# EAGLE design tiny44teardrop_v3 (EAGLE 6.5.0)
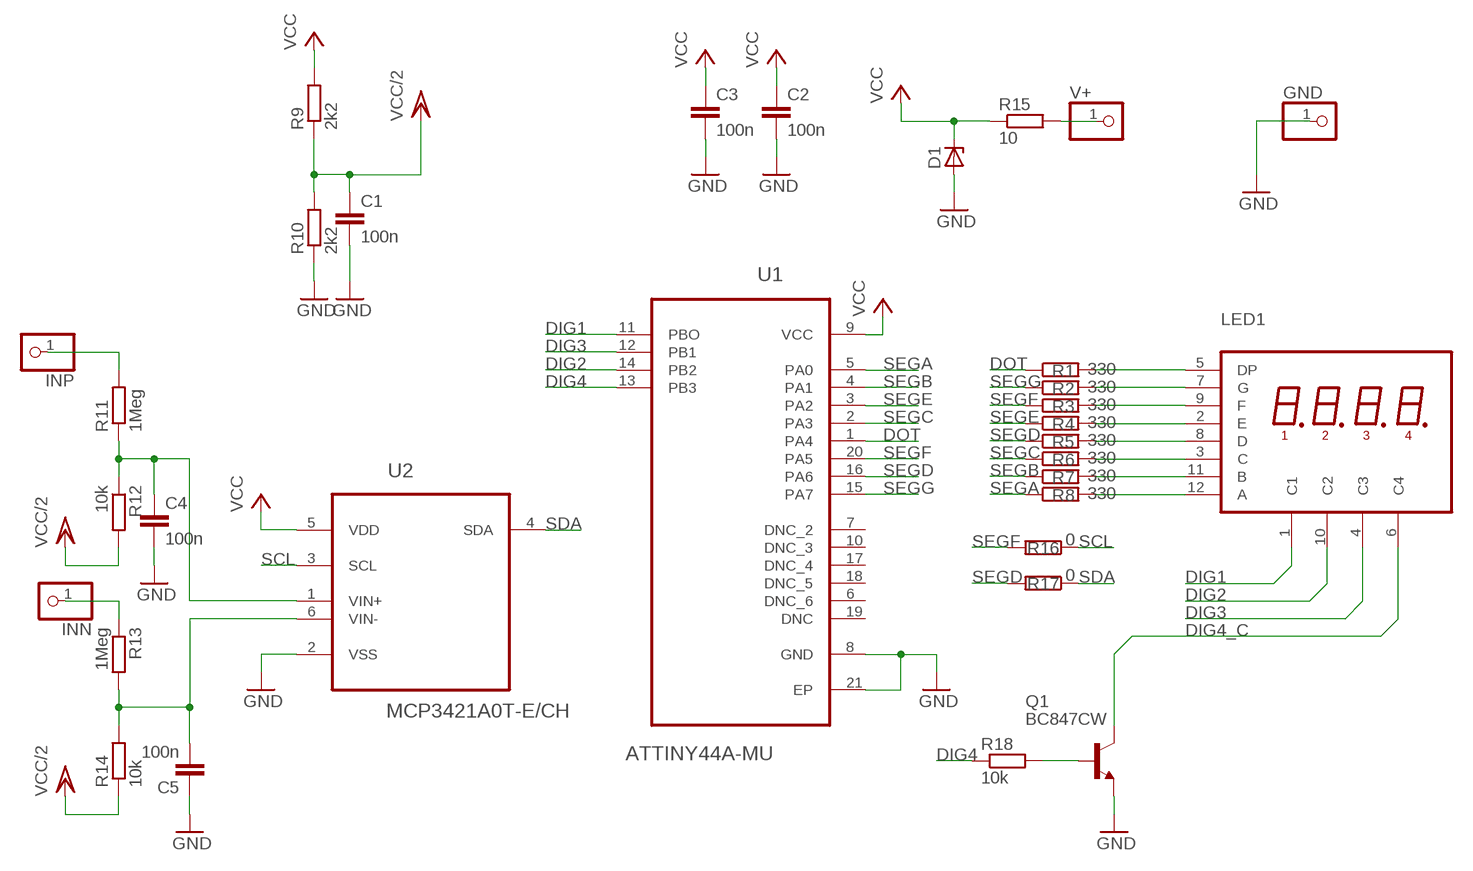
[diagram p0: schematic, sheet 1]

## Parts
C1  100n  C-EUC0603K  [C0603K]
C2  100n  C-EUC0603K  [C0603K]
C3  100n  C-EUC0603K  [C0603K]
C4  100n  C-EUC0603K  [C0603K]
C5  100n  C-EUC0603K  [C0603K]
D1  BZX84CSMDBZT52C3V3S-7-F  [SOD323-R]
GND  PINHD-1X1  [1X01]
INN  PINHD-1X1  [1X01]
INP  PINHD-1X1  [1X01]
LED1  5082-7414  [5082-7414]
Q1  BC847CW  BC847BC847CW  [SOT323-BEC]
R1  330  R-EU_R0402  [R0402]
R2  330  R-EU_R0402  [R0402]
R3  330  R-EU_R0402  [R0402]
R4  330  R-EU_R0402  [R0402]
R5  330  R-EU_R0402  [R0402]
R6  330  R-EU_R0402  [R0402]
R7  330  R-EU_R0402  [R0402]
R8  330  R-EU_R0402  [R0402]
R9  2k2  R-EU_R0402  [R0402]
R10  2k2  R-EU_R0402  [R0402]
R11  1Meg  R-EU_R0603  [R0603]
R12  10k  R-EU_R0402  [R0402]
R13  1Meg  R-EU_R0603  [R0603]
R14  10k  R-EU_R0402  [R0402]
R15  10  R-EU_R0402  [R0402]
R16  0  R-EU_R0402  [R0402]
R17  0  R-EU_R0402  [R0402]
R18  10k  R-EU_R0402  [R0402]
U1  ATTINY44A-MU  [QFN50P400X400X80-21N]
U2  MCP3421A0T-E/CH  [SOT95P270X145-6N]
V+  PINHD-1X1  [1X01]

## Nets
DIG1: LED1.1(C1) U1.11(PBO)
DIG2: LED1.10(C2) U1.14(PB2)
DIG3: LED1.4(C3) U1.12(PB1)
DIG4: R18.1 U1.13(PB3)
DIG4_C: LED1.6(C4) Q1.C
DOT: R1.1 U1.1(PA4)
GND: C1.2 C2.2 C3.2 C4.2 C5.1 D1.A GND.1 Q1.E R10.1 U1.8(GND) U1.21(EP) U2.2(VSS)
N$1: LED1.5(DP) R1.2
N$2: LED1.7(G) R2.2
N$3: R15.2 V+.1
N$4: LED1.2(E) R4.2
N$5: LED1.9(F) R3.2
N$6: LED1.3(C) R6.2
N$7: LED1.11(B) R7.2
N$8: LED1.12(A) R8.2
N$9: LED1.8(D) R5.2
N$10: INP.1 R11.2
N$11: Q1.B R18.2
N$12: INN.1 R13.1
N$13: C5.2 R13.2 R14.2 U2.6(VIN-)
N$15: C4.1 R11.1 R12.1 U2.1(VIN+)
SCL: R16.1 U2.3(SCL)
SDA: R17.1 U2.4(SDA)
SEGA: R8.1 U1.5(PA0)
SEGB: R7.1 U1.4(PA1)
SEGC: R6.1 U1.2(PA3)
SEGD: R5.1 R17.2 U1.16(PA6)
SEGE: R4.1 U1.3(PA2)
SEGF: R3.1 R16.2 U1.20(PA5)
SEGG: R2.1 U1.15(PA7)
VCC: C2.1 C3.1 D1.C R9.2 R15.1 U1.9(VCC) U2.5(VDD)
VCC/2: C1.1 R9.1 R10.2 R12.2 R14.1
Unconnected: U1.6(DNC_6) U1.7(DNC_2) U1.10(DNC_3) U1.17(DNC_4) U1.18(DNC_5) U1.19(DNC)

## Library data of the parts
C1-C5 = untitled:C-EU: CAPACITOR, European symbol
D1 = untitled:BZX84CSMD: Z DIODE
GND INN INP V+ = pinhead:PINHD-1X1: PIN HEADER
LED1 = untitled:5082-7414: 4 digits X 7-segment + DP LED display
Q1 = untitled:BC847*: NPN Transistor
R1-R18 = untitled:R-EU_: RESISTOR, European symbol
U1 = untitled:ATTINY44A-MU: Microcontroller with In-System Programmable Flash; MPN: ATTINY44A-MU; OC_FARNELL: 1748545; OC_NEWARK: 26R5651; PACKAGE: QFN-20; SUPPLIER: Atmel
U2 = untitled:MCP3421A0T-E/CH: Analog-to-Digital Converter; MPN: MCP3421A0T-E/CH; OC_FARNELL: 1605567; OC_NEWARK: 77M2561; PACKAGE: SOT-6; SUPPLIER: Microchip

## Board
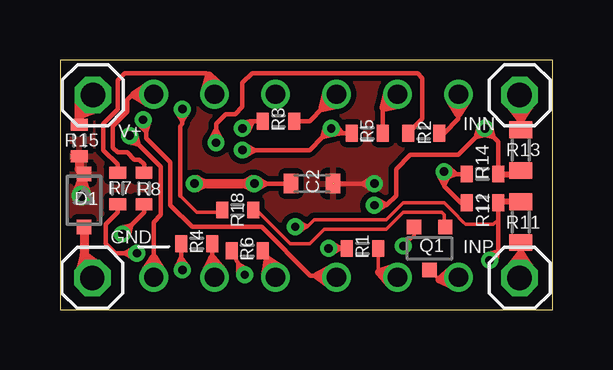
[diagram p1: board, top side]
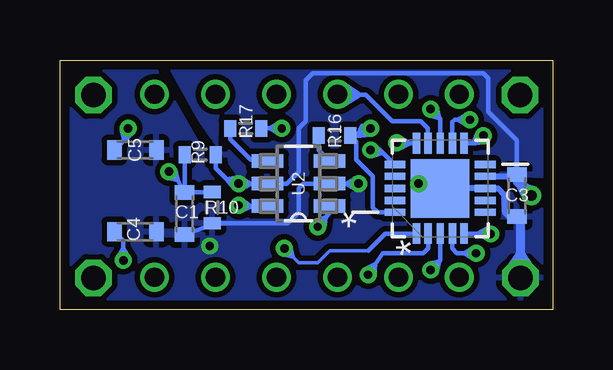
[diagram p2: board, bottom side, seen from below]

Size 20.54 x 10.4 mm. Coordinates in mm from the lower left corner, seen from the top.
Outline: 0,0 20.54,0 20.54,10.4 0,10.4 0,0
Copper layers (1*16): Top 0.0356mm / dielectric 1.5011mm / Bottom 0.0356mm
Design rules "LaenPCBOrder *": minimum track width 6mil, minimum drill 13mil, track to track 6mil, track to pad 6mil, pad to pad 6mil, via to via 6mil, smd to smd 6mil, copper to edge 15mil, drill to drill 6mil, minimum pad ring 7mil, minimum via ring 7mil, stop-mask expansion 3mil, vias tented up to drill 23mil, thermal gap 10mil

### Footprints (pad centres in the part's own frame; a part is rotated, then mirrored left to right if it is on the bottom)
C0603K = smd 0.6 x 0.8: 1 -0.875,0; 2 0.875,0
SOD323-R = smd 0.6 x 0.6: A 1.1,0; C -1.1,0
1X01 = drill 1.016 octagon: 1 0,0
5082-7414 = drill 0.8: 1 0,0; 2 2.54,0; 3 5.08,0; 4 7.62,0; 5 10.16,0; 6 12.7,0; 7 12.7,7.62; 8 10.16,7.62; 9 7.62,7.62; 10 5.08,7.62; 11 2.54,7.62; 12 0,7.62
SOT323-BEC = smd 0.6 x 0.6: B -0.65,-0.9; C 0,0.9; E 0.65,-0.9
R0402 = smd 0.5 x 0.7: 1 -0.65,0; 2 0.65,0
R0603 = smd 0.7 x 0.95: 1 -0.85,0; 2 0.85,0
QFN50P400X400X80-21N = smd 0.864 x 0.305: 1 -1.88,0.991; 2 -1.88,0.508; 3 -1.88,0; 4 -1.88,-0.508; 5 -1.88,-0.991; 11 1.88,-0.991; 12 1.88,-0.508; 13 1.88,0; 14 1.88,0.508; 15 1.88,0.991 | smd 0.305 x 0.864: 6 -0.991,-1.88; 7 -0.508,-1.88; 8 0,-1.88; 9 0.508,-1.88; 10 0.991,-1.88; 16 0.991,1.88; 17 0.508,1.88; 18 0,1.88; 19 -0.508,1.88; 20 -0.991,1.88 | smd 2.438 x 2.438: 21 0,0
SOT95P270X145-6N = smd 1.321 x 0.559: 1 -1.295,0.94; 2 -1.295,0; 3 -1.295,-0.94; 4 1.295,-0.94; 5 1.295,0; 6 1.295,0.94

### Placement (x,y rotation side)
C1  15.35,4 270 bottom
C2  10.5,5.25 180 top
C3  1.5,4.75 270 bottom
C4  17.4,3.25 0 bottom
C5  17.4,6.65 180 bottom
D1  1,4.55 270 top
GND  1.35,1.32 0 top
INN  19.15,8.94 0 top
INP  19.15,1.32 0 top
LED1  3.9,1.35 0 top
Q1  15.4,2.55 180 top
R1  12.6,2.55 0 top
R2  15.15,7.35 0 top
R3  9.1,7.85 0 top
R4  5.7,2.75 0 top
R5  12.8,7.35 0 top
R6  7.8,2.45 0 top
R7  2.4,5.05 90 top
R8  3.5,5.05 90 top
R9  14.7,6.45 0 bottom
R10  14.2,4.25 90 bottom
R11  19.2,3.65 270 top
R12  17.6,4.45 180 top
R13  19.2,6.65 270 top
R14  17.6,5.65 0 top
R15  0.8,7.05 90 top
R16  9.1,7.25 0 bottom
R17  12.8,7.55 0 bottom
R18  7.4,4.15 0 top
U1  4.7,5.05 90 bottom
U2  10.6,5.25 180 bottom
V+  1.37,8.94 0 top

### Tracks (layer width: path | path; a pad name or v marks a point on that pad's centre or on a via)
DIG1  (via drill 0.35 pad 0.7)
  Top 0.178: 3.27,6.88 4.2,5.95 4.2,3.95 3.9,3.65 3.9,2.15 LED1.1 | 3.27,6.88 v2.9,7.25 | v2.9,7.25 3.16,7.29 3.22,6.93 2.86,6.99 v2.9,7.25 | 3.27,6.88 3.16,7.32 | v2.9,7.25 3.16,7.32 | 3.27,6.88 2.83,7 | v2.9,7.25 2.83,7 | 3.27,6.88 3.16,7.32 | v2.9,7.25 3.16,7.32 | 3.27,6.88 2.83,7 | v2.9,7.25 2.83,7 | 3.27,6.88 3.16,7.32 | v2.9,7.25 3.16,7.32 | 3.27,6.88 2.83,7 | v2.9,7.25 2.83,7 | 3.27,6.88 3.16,7.32 | v2.9,7.25 3.16,7.32 | 3.27,6.88 2.83,7 | v2.9,7.25 2.83,7
  Top 0.356: LED1.1 3.58,1.63 3.9,1.99 4.22,1.63 LED1.1 | 3.9,2.15 3.54,1.57 | LED1.1 3.54,1.57 | 3.9,2.15 4.26,1.57 | LED1.1 4.26,1.57 | 3.9,2.15 3.54,1.57 | LED1.1 3.54,1.57 | 3.9,2.15 4.26,1.57 | LED1.1 4.26,1.57 | 3.9,2.15 3.54,1.57 | LED1.1 3.54,1.57 | 3.9,2.15 4.26,1.57 | LED1.1 4.26,1.57 | 3.9,2.15 3.54,1.57 | LED1.1 3.54,1.57 | 3.9,2.15 4.26,1.57 | LED1.1 4.26,1.57
  Bottom 0.178: U1.11 3.32,6.93 | 3.32,6.93 3.22,6.93 v2.9,7.25 | v2.9,7.25 3.16,7.29 3.22,6.93 2.86,6.99 v2.9,7.25 | 3.32,6.93 3.14,7.35 | v2.9,7.25 3.14,7.35 | 3.32,6.93 2.87,6.99 | v2.9,7.25 2.87,6.99 | 3.32,6.93 3.14,7.35 | v2.9,7.25 3.14,7.35 | 3.32,6.93 2.87,6.99 | v2.9,7.25 2.87,6.99 | 3.32,6.93 3.14,7.35 | v2.9,7.25 3.14,7.35 | 3.32,6.93 2.87,6.99 | v2.9,7.25 2.87,6.99 | 3.32,6.93 3.14,7.35 | v2.9,7.25 3.14,7.35 | 3.32,6.93 2.87,6.99 | v2.9,7.25 2.87,6.99
DIG2
  Bottom 0.178: U1.14 5.21,7.56 5.5,7.85 6.7,7.85 7.8,8.95 8.18,8.95 8.96,8.95 LED1.10
  Bottom 0.356: 8.18,8.95 8.77,8.61 | LED1.10 8.77,8.61 | 8.18,8.95 8.75,9.32 | LED1.10 8.75,9.32 | 8.18,8.95 8.77,8.61 | LED1.10 8.77,8.61 | 8.18,8.95 8.75,9.32 | LED1.10 8.75,9.32 | 8.18,8.95 8.77,8.61 | LED1.10 8.77,8.61 | 8.18,8.95 8.75,9.32 | LED1.10 8.75,9.32 | 8.18,8.95 8.77,8.61 | LED1.10 8.77,8.61 | 8.18,8.95 8.75,9.32 | LED1.10 8.75,9.32
DIG3  (via drill 0.35 pad 0.7)
  Top 0.178: 3.6,7.4 3.6,7.15 4.6,6.15 4.6,4.35 5.5,3.45 8.4,3.45 10.43,1.42 10.72,1.42 11.45,1.42 LED1.4 | 3.6,7.4 3.6,7.85 v3.46,7.91 | v3.46,7.91 3.71,7.83 3.6,7.48 3.3,7.7 v3.46,7.91 | 3.6,7.4 3.72,7.84 | v3.46,7.91 3.72,7.84 | 3.6,7.4 3.27,7.72 | v3.46,7.91 3.27,7.72 | 3.6,7.4 3.72,7.84 | v3.46,7.91 3.72,7.84 | 3.6,7.4 3.27,7.72 | v3.46,7.91 3.27,7.72 | 3.6,7.4 3.72,7.84 | v3.46,7.91 3.72,7.84 | 3.6,7.4 3.27,7.72 | v3.46,7.91 3.27,7.72 | 3.6,7.4 3.72,7.84 | v3.46,7.91 3.72,7.84 | 3.6,7.4 3.27,7.72 | v3.46,7.91 3.27,7.72
  Top 0.356: LED1.4 11.21,1.06 10.88,1.42 11.28,1.7 LED1.4 | 10.72,1.42 11.27,1.01 | LED1.4 11.27,1.01 | 10.72,1.42 11.33,1.73 | LED1.4 11.33,1.73 | 10.72,1.42 11.27,1.01 | LED1.4 11.27,1.01 | 10.72,1.42 11.33,1.73 | LED1.4 11.33,1.73 | 10.72,1.42 11.27,1.01 | LED1.4 11.27,1.01 | 10.72,1.42 11.33,1.73 | LED1.4 11.33,1.73 | 10.72,1.42 11.27,1.01 | LED1.4 11.27,1.01 | 10.72,1.42 11.33,1.73 | LED1.4 11.33,1.73
  Bottom 0.178: U1.12 4.19,7.82 4.1,7.91 3.98,7.91 | 3.98,7.91 | 3.98,7.91 v3.46,7.91 | v3.46,7.91 3.61,8.12 3.92,7.91 3.61,7.69 v3.46,7.91 | 3.98,7.91 3.59,8.14 | v3.46,7.91 3.59,8.14 | 3.98,7.91 | 3.98,7.91 3.59,7.68 | v3.46,7.91 3.59,7.68 | 3.98,7.91 3.59,8.14 | v3.46,7.91 3.59,8.14 | 3.98,7.91 3.59,7.68 | v3.46,7.91 3.59,7.68 | 3.98,7.91 3.59,8.14 | v3.46,7.91 3.59,8.14 | 3.98,7.91 3.59,7.68 | v3.46,7.91 3.59,7.68 | 3.98,7.91 3.59,8.14 | v3.46,7.91 3.59,8.14 | 3.98,7.91 3.59,7.68 | v3.46,7.91 3.59,7.68 | 3.98,7.91 3.59,8.14 | v3.46,7.91 3.59,8.14 | 3.98,7.91 3.59,7.68 | v3.46,7.91 3.59,7.68 | 3.98,7.91 3.59,8.14 | v3.46,7.91 3.59,8.14 | 3.98,7.91 3.59,7.68 | v3.46,7.91 3.59,7.68 | 3.98,7.91 3.59,8.14 | v3.46,7.91 3.59,8.14 | 3.98,7.91 3.59,7.68 | v3.46,7.91 3.59,7.68 | 3.98,7.91 3.59,8.14 | v3.46,7.91 3.59,8.14 | 3.98,7.91 3.59,7.68 | v3.46,7.91 3.59,7.68 | 3.98,7.91 3.59,8.14 | v3.46,7.91 3.59,8.14 | 3.98,7.91 3.59,7.68 | v3.46,7.91 3.59,7.68 | 3.98,7.91 3.59,8.14 | v3.46,7.91 3.59,8.14 | 3.98,7.91 3.59,7.68 | v3.46,7.91 3.59,7.68
DIG4  (via drill 0.35 pad 0.7)
  Top 0.152: R18.1 6.65,4.05 5.7,4.05 5,4.75
  Top 0.178: 5,4.75 5,7.65 5.1,7.75 5.1,7.83 | v5.1,8.35 5.1,7.83 | 5.1,7.83 | v5.1,8.35 5.31,8.2 5.1,7.89 4.88,8.2 v5.1,8.35 | 5.1,7.83 5.33,8.22 | v5.1,8.35 5.33,8.22 | 5.1,7.83 | 5.1,7.83 4.87,8.22 | v5.1,8.35 4.87,8.22 | 5.1,7.83 5.33,8.22 | v5.1,8.35 5.33,8.22 | 5.1,7.83 4.87,8.22 | v5.1,8.35 4.87,8.22 | 5.1,7.83 5.33,8.22 | v5.1,8.35 5.33,8.22 | 5.1,7.83 4.87,8.22 | v5.1,8.35 4.87,8.22 | 5.1,7.83 5.33,8.22 | v5.1,8.35 5.33,8.22 | 5.1,7.83 4.87,8.22 | v5.1,8.35 4.87,8.22 | 5.1,7.83 5.33,8.22 | v5.1,8.35 5.33,8.22 | 5.1,7.83 4.87,8.22 | v5.1,8.35 4.87,8.22 | 5.1,7.83 5.33,8.22 | v5.1,8.35 5.33,8.22 | 5.1,7.83 4.87,8.22 | v5.1,8.35 4.87,8.22 | 5.1,7.83 5.33,8.22 | v5.1,8.35 5.33,8.22 | 5.1,7.83 4.87,8.22 | v5.1,8.35 4.87,8.22 | 5.1,7.83 5.33,8.22 | v5.1,8.35 5.33,8.22 | 5.1,7.83 4.87,8.22 | v5.1,8.35 4.87,8.22 | 5.1,7.83 5.33,8.22 | v5.1,8.35 5.33,8.22 | 5.1,7.83 4.87,8.22 | v5.1,8.35 4.87,8.22 | 5.1,7.83 5.33,8.22 | v5.1,8.35 5.33,8.22 | 5.1,7.83 4.87,8.22 | v5.1,8.35 4.87,8.22
  Bottom 0.178: U1.13 4.7,7.95 4.73,7.98 | 4.73,7.98 v5.1,8.35 | v5.1,8.35 5.14,8.09 4.78,8.03 4.84,8.39 v5.1,8.35 | 4.73,7.98 5.17,8.1 | v5.1,8.35 5.17,8.1 | 4.73,7.98 4.84,8.42 | v5.1,8.35 4.84,8.42 | 4.73,7.98 5.17,8.1 | v5.1,8.35 5.17,8.1 | 4.73,7.98 4.84,8.42 | v5.1,8.35 4.84,8.42 | 4.73,7.98 5.17,8.1 | v5.1,8.35 5.17,8.1 | 4.73,7.98 4.84,8.42 | v5.1,8.35 4.84,8.42 | 4.73,7.98 5.17,8.1 | v5.1,8.35 5.17,8.1 | 4.73,7.98 4.84,8.42 | v5.1,8.35 4.84,8.42
DIG4_C
  Top 0.152: Q1.C 15.81,1.25 16.5,1.25 LED1.6
  Top 0.178: LED1.6
  Top 0.305: 15.81,1.25 16.4,0.95 | LED1.6 16.4,0.95 | 15.81,1.25 16.3,1.69 | LED1.6 16.3,1.69 | 15.81,1.25 16.4,0.95 | LED1.6 16.4,0.95 | 15.81,1.25 16.3,1.69 | LED1.6 16.3,1.69 | 15.81,1.25 16.4,0.95 | LED1.6 16.4,0.95 | 15.81,1.25 16.3,1.69 | LED1.6 16.3,1.69 | 15.81,1.25 16.4,0.95 | LED1.6 16.4,0.95 | 15.81,1.25 16.3,1.69 | LED1.6 16.3,1.69
DOT  (via drill 0.35 pad 0.7)
  Top 0.178: R1.1 11.71,2.55 | 11.71,2.55 | 11.71,2.55 v11.19,2.55 | v11.19,2.55 11.34,2.76 11.64,2.55 11.34,2.33 v11.19,2.55 | 11.71,2.55 11.32,2.78 | v11.19,2.55 11.32,2.78 | 11.71,2.55 | 11.71,2.55 11.32,2.32 | v11.19,2.55 11.32,2.32 | 11.71,2.55 11.32,2.78 | v11.19,2.55 11.32,2.78 | 11.71,2.55 11.32,2.32 | v11.19,2.55 11.32,2.32 | 11.71,2.55 11.32,2.78 | v11.19,2.55 11.32,2.78 | 11.71,2.55 11.32,2.32 | v11.19,2.55 11.32,2.32 | 11.71,2.55 11.32,2.78 | v11.19,2.55 11.32,2.78 | 11.71,2.55 11.32,2.32 | v11.19,2.55 11.32,2.32 | 11.71,2.55 11.32,2.78 | v11.19,2.55 11.32,2.78 | 11.71,2.55 11.32,2.32 | v11.19,2.55 11.32,2.32 | 11.71,2.55 11.32,2.78 | v11.19,2.55 11.32,2.78 | 11.71,2.55 11.32,2.32 | v11.19,2.55 11.32,2.32 | 11.71,2.55 11.32,2.78 | v11.19,2.55 11.32,2.78 | 11.71,2.55 11.32,2.32 | v11.19,2.55 11.32,2.32 | 11.71,2.55 11.32,2.78 | v11.19,2.55 11.32,2.78 | 11.71,2.55 11.32,2.32 | v11.19,2.55 11.32,2.32 | 11.71,2.55 11.32,2.78 | v11.19,2.55 11.32,2.78 | 11.71,2.55 11.32,2.32 | v11.19,2.55 11.32,2.32 | 11.71,2.55 11.32,2.78 | v11.19,2.55 11.32,2.78 | 11.71,2.55 11.32,2.32 | v11.19,2.55 11.32,2.32
  Bottom 0.152: 7.7,2.45 9.3,2.45 9.8,1.95 10.6,1.95 10.6,1.96 10.82,2.18 | 10.82,2.18 v11.19,2.55 | 10.82,2.18 11.25,2.28 | v11.19,2.55 11.25,2.28 | 10.82,2.18 10.92,2.61 | v11.19,2.55 10.92,2.61 | 10.82,2.18 11.25,2.28 | v11.19,2.55 11.25,2.28 | 10.82,2.18 10.92,2.61 | v11.19,2.55 10.92,2.61 | 10.82,2.18 11.25,2.28 | v11.19,2.55 11.25,2.28 | 10.82,2.18 10.92,2.61 | v11.19,2.55 10.92,2.61 | 10.82,2.18 11.25,2.28 | v11.19,2.55 11.25,2.28 | 10.82,2.18 10.92,2.61 | v11.19,2.55 10.92,2.61
  Bottom 0.178: U1.1 6.98,3.17 7.7,2.45
GND  (via drill 0.35 pad 0.7)
  Top 0.152: Q1.E 14.75,3.1 v14.3,2.65
  Top 0.178: C2.2 8.62,5.25 | 8.62,5.25 | 8.62,5.25 v8.1,5.25 | v8.1,5.25 8.25,5.46 8.55,5.25 8.25,5.04 v8.1,5.25 | 8.62,5.25 8.23,5.48 | v8.1,5.25 8.23,5.48 | 8.62,5.25 | 8.62,5.25 8.23,5.02 | v8.1,5.25 8.23,5.02 | 8.62,5.25 8.23,5.48 | v8.1,5.25 8.23,5.48 | 8.62,5.25 8.23,5.02 | v8.1,5.25 8.23,5.02 | 8.62,5.25 8.23,5.48 | v8.1,5.25 8.23,5.48 | 8.62,5.25 8.23,5.02 | v8.1,5.25 8.23,5.02 | 8.62,5.25 8.23,5.48 | v8.1,5.25 8.23,5.48 | 8.62,5.25 8.23,5.02 | v8.1,5.25 8.23,5.02 | 8.62,5.25 8.23,5.48 | v8.1,5.25 8.23,5.48 | 8.62,5.25 8.23,5.02 | v8.1,5.25 8.23,5.02 | 8.62,5.25 8.23,5.48 | v8.1,5.25 8.23,5.48 | 8.62,5.25 8.23,5.02 | v8.1,5.25 8.23,5.02 | 8.62,5.25 8.23,5.48 | v8.1,5.25 8.23,5.48 | 8.62,5.25 8.23,5.02 | v8.1,5.25 8.23,5.02 | 8.62,5.25 8.23,5.48 | v8.1,5.25 8.23,5.48 | 8.62,5.25 8.23,5.02 | v8.1,5.25 8.23,5.02 | 8.62,5.25 8.23,5.48 | v8.1,5.25 8.23,5.48 | 8.62,5.25 8.23,5.02 | v8.1,5.25 8.23,5.02 | 8.62,5.25 8.23,5.48 | v8.1,5.25 8.23,5.48 | 8.62,5.25 8.23,5.02 | v8.1,5.25 8.23,5.02
  Top 0.254: v8.1,5.25 7.57,5.25 | v8.1,5.25 7.99,5.05 | v8.1,5.25 7.99,5.45 | 6.05,5.25 5.71,5.45 | 7.57,5.25 | 7.57,5.25 | 8,5.05 | 6.12,5.25 5.7,5.45 | 5.7,5.45 | 7.57,5.25 8,5.05 | v8.1,5.25 8,5.05 | 7.57,5.25 8,5.45 v8.1,5.25 | 6.12,5.25 5.7,5.45 | 5.7,5.45 v5.6,5.25 5.7,5.05 6.12,5.25
  Top 0.305: 6.12,5.25 v5.6,5.25 | 7.99,5.05 7.64,5.25 7.99,5.45 | v5.6,5.25 5.71,5.45 | 6.05,5.25 5.71,5.05 v5.6,5.25 | 7.57,5.25 8,5.45 | 7.57,5.25 8,5.05 | v8.1,5.25 8,5.05 | 7.57,5.25 8,5.45 | v8.1,5.25 8,5.45 | 7.57,5.25 8,5.05 | v8.1,5.25 8,5.05 | 7.57,5.25 8,5.45 | v8.1,5.25 8,5.45 | v5.6,5.25 5.7,5.45 | 6.12,5.25 5.7,5.05 | v5.6,5.25 5.7,5.05 | 6.12,5.25 5.7,5.45 | v5.6,5.25 5.7,5.45 | 6.12,5.25 5.7,5.05 | v5.6,5.25 5.7,5.05 | 7.57,5.25 8.02,5.06 | v8.1,5.25 8.02,5.06 | 7.57,5.25 8.02,5.43 | v8.1,5.25 8.02,5.43 | 7.57,5.25 8.02,5.06 | v8.1,5.25 8.02,5.06 | 7.57,5.25 8.02,5.43 | v8.1,5.25 8.02,5.43 | 7.57,5.25 8.02,5.06 | v8.1,5.25 8.02,5.06 | 7.57,5.25 8.02,5.43 | v8.1,5.25 8.02,5.43 | 7.57,5.25 8.02,5.06 | v8.1,5.25 8.02,5.06 | 7.57,5.25 8.02,5.43 | v8.1,5.25 8.02,5.43 | 7.57,5.25 8.02,5.06 | v8.1,5.25 8.02,5.06 | 7.57,5.25 8.02,5.43 | v8.1,5.25 8.02,5.43 | 6.12,5.25 5.68,5.43 | v5.6,5.25 5.68,5.43 | 6.12,5.25 5.68,5.06 | v5.6,5.25 5.68,5.06 | 6.12,5.25 5.68,5.43 | v5.6,5.25 5.68,5.43 | 6.12,5.25 5.68,5.06 | v5.6,5.25 5.68,5.06 | 6.12,5.25 5.68,5.43 | v5.6,5.25 5.68,5.43 | 6.12,5.25 5.68,5.06 | v5.6,5.25 5.68,5.06 | 6.12,5.25 5.68,5.43 | v5.6,5.25 5.68,5.43 | 6.12,5.25 5.68,5.06 | v5.6,5.25 5.68,5.06
  Top 0.381: D1.A 1,2.27 | 1,2.27 1,1.67 GND.1 | GND.1 0.81,1.51 1,2.05 1.54,1.86 GND.1 | 1,2.27 0.79,1.46 | GND.1 0.79,1.46 | 1,2.27 1.68,1.78 | GND.1 1.68,1.78 | 1,2.27 0.79,1.46 | GND.1 0.79,1.46 | 1,2.27 1.68,1.78 | GND.1 1.68,1.78 | 1,2.27 0.79,1.46 | GND.1 0.79,1.46 | 1,2.27 1.68,1.78 | GND.1 1.68,1.78 | 1,2.27 0.79,1.46 | GND.1 0.79,1.46 | 1,2.27 1.68,1.78 | GND.1 1.68,1.78
  Top 0.4: 7.57,5.25 6.12,5.25
  Bottom 0.178: v8.1,5.25 8.62,5.25 | 8.62,5.25 | 8.62,5.25 U2.2 10.4,5.25 10.6,5.05 10.6,4.05 11.05,3.6 R10.1 14.28,3.52 C1.2 | v8.1,5.25 8.25,5.46 8.55,5.25 8.25,5.04 v8.1,5.25 | 8.62,5.25 8.23,5.48 | v8.1,5.25 8.23,5.48 | 8.62,5.25 | 8.62,5.25 8.23,5.02 | v8.1,5.25 8.23,5.02 | 8.62,5.25 8.23,5.48 | v8.1,5.25 8.23,5.48 | 8.62,5.25 8.23,5.02 | v8.1,5.25 8.23,5.02 | 8.62,5.25 8.23,5.48 | v8.1,5.25 8.23,5.48 | 8.62,5.25 8.23,5.02 | v8.1,5.25 8.23,5.02 | 8.62,5.25 8.23,5.48 | v8.1,5.25 8.23,5.48 | 8.62,5.25 8.23,5.02 | v8.1,5.25 8.23,5.02 | 8.62,5.25 8.23,5.48 | v8.1,5.25 8.23,5.48 | 8.62,5.25 8.23,5.02 | v8.1,5.25 8.23,5.02 | 8.62,5.25 8.23,5.48 | v8.1,5.25 8.23,5.48 | 8.62,5.25 8.23,5.02 | v8.1,5.25 8.23,5.02 | 8.62,5.25 8.23,5.48 | v8.1,5.25 8.23,5.48 | 8.62,5.25 8.23,5.02 | v8.1,5.25 8.23,5.02 | 8.62,5.25 8.23,5.48 | v8.1,5.25 8.23,5.48 | 8.62,5.25 8.23,5.02 | v8.1,5.25 8.23,5.02 | 8.62,5.25 8.23,5.48 | v8.1,5.25 8.23,5.48 | 8.62,5.25 8.23,5.02 | v8.1,5.25 8.23,5.02 | 8.62,5.25 8.23,5.48 | v8.1,5.25 8.23,5.48 | 8.62,5.25 8.23,5.02 | v8.1,5.25 8.23,5.02
  Bottom 0.254: 5.11,5.05 5.1,5.05 U1.21 U1.8 2.3,5.05 2,4.75 2,4.05 1.83,3.88 C3.2 | 5.11,5.05 v5.6,5.25 | v5.6,5.25 5.57,5.03 5.18,5.08 5.42,5.39 v5.6,5.25 | 5.11,5.05 5.59,5.02 | v5.6,5.25 5.59,5.02 | 5.11,5.05 5.43,5.4 | 5.43,5.4 | v5.6,5.25 5.43,5.4 | 5.11,5.05 5.59,5.02 | v5.6,5.25 5.59,5.02 | 5.11,5.05 5.43,5.4 | v5.6,5.25 5.43,5.4 | 5.11,5.05 5.59,5.02 | v5.6,5.25 5.59,5.02 | 5.11,5.05 5.43,5.4 | v5.6,5.25 5.43,5.4 | 5.11,5.05 5.59,5.02 | v5.6,5.25 5.59,5.02 | 5.11,5.05 5.43,5.4 | v5.6,5.25 5.43,5.4 | 5.11,5.05 5.59,5.02 | v5.6,5.25 5.59,5.02 | 5.11,5.05 5.43,5.4 | v5.6,5.25 5.43,5.4 | 5.11,5.05 5.59,5.02 | v5.6,5.25 5.59,5.02 | 5.11,5.05 5.43,5.4 | v5.6,5.25 5.43,5.4 | 5.11,5.05 5.59,5.02 | v5.6,5.25 5.59,5.02 | 5.11,5.05 5.43,5.4 | v5.6,5.25 5.43,5.4
  Bottom 0.381: GND.1 1.35,2.34 | 1.35,2.34 1.35,3.82 C3.2 | GND.1 0.94,1.72 1.35,2.13 1.75,1.72 GND.1 | 1.35,2.34 0.87,1.64 | GND.1 0.87,1.64 | 1.35,2.34 1.82,1.64 | GND.1 1.82,1.64 | 1.35,2.34 0.87,1.64 | GND.1 0.87,1.64 | 1.35,2.34 1.82,1.64 | GND.1 1.82,1.64 | 1.35,2.34 0.87,1.64 | GND.1 0.87,1.64 | 1.35,2.34 1.82,1.64 | GND.1 1.82,1.64 | 1.35,2.34 0.87,1.64 | GND.1 0.87,1.64 | 1.35,2.34 1.82,1.64 | GND.1 1.82,1.64
  pour Bottom (isolate 0.229): 0,4.85 13.6,4.85 16.8,10.45 20.4,10.45 20.4,-0.05 0,-0.05
N$1
  Top 0.152: R1.2 13.25,1.6 13.29,1.56 13.5,1.35 LED1.5
  Top 0.305: 13.29,1.56 13.72,1.06 | LED1.5 13.72,1.06 | 13.29,1.56 13.92,1.77 | LED1.5 13.92,1.77 | 13.29,1.56 13.72,1.06 | LED1.5 13.72,1.06 | 13.29,1.56 13.92,1.77 | LED1.5 13.92,1.77 | 13.29,1.56 13.72,1.06 | LED1.5 13.72,1.06 | 13.29,1.56 13.92,1.77 | LED1.5 13.92,1.77 | 13.29,1.56 13.72,1.06 | LED1.5 13.72,1.06 | 13.29,1.56 13.92,1.77 | LED1.5 13.92,1.77
N$2
  Top 0.178: R2.2 16,7.35 16.6,7.95 16.6,8.17 LED1.7
  Top 0.356: LED1.7 16.92,8.69 16.6,8.33 16.28,8.69 LED1.7 | 16.6,8.17 16.96,8.75 | LED1.7 16.96,8.75 | 16.6,8.17 16.24,8.75 | LED1.7 16.24,8.75 | 16.6,8.17 16.96,8.75 | LED1.7 16.96,8.75 | 16.6,8.17 16.24,8.75 | LED1.7 16.24,8.75 | 16.6,8.17 16.96,8.75 | LED1.7 16.96,8.75 | 16.6,8.17 16.24,8.75 | LED1.7 16.24,8.75 | 16.6,8.17 16.96,8.75 | LED1.7 16.96,8.75 | 16.6,8.17 16.24,8.75 | LED1.7 16.24,8.75
N$3
  Top 0.381: V+.1 0.8,8.37 0.8,8.1 | R15.2 0.8,8.1 | V+.1 1.38,8.37 0.8,8.36 0.8,8.94 V+.1 | 0.8,8.1 1.58,8.41 | V+.1 1.58,8.41 | 0.8,8.1 0.8,8.94 | V+.1 0.8,8.94 | 0.8,8.1 1.58,8.41 | V+.1 1.58,8.41 | 0.8,8.1 0.8,8.94 | V+.1 0.8,8.94 | 0.8,8.1 1.58,8.41 | V+.1 1.58,8.41 | 0.8,8.1 0.8,8.94 | V+.1 0.8,8.94 | 0.8,8.1 1.58,8.41 | V+.1 1.58,8.41 | 0.8,8.1 0.8,8.94 | V+.1 0.8,8.94
N$4
  Top 0.178: R4.2 6.35,2.15 6.35,1.42 6.42,1.35 LED1.2
  Top 0.356: LED1.2 6.09,1.58 6.35,1.98 6.71,1.67 LED1.2 | 6.35,2.15 6.06,1.53 | LED1.2 6.06,1.53 | 6.35,2.15 6.77,1.61 | LED1.2 6.77,1.61 | 6.35,2.15 6.06,1.53 | LED1.2 6.06,1.53 | 6.35,2.15 6.77,1.61 | LED1.2 6.77,1.61 | 6.35,2.15 6.06,1.53 | LED1.2 6.06,1.53 | 6.35,2.15 6.77,1.61 | LED1.2 6.77,1.61 | 6.35,2.15 6.06,1.53 | LED1.2 6.06,1.53 | 6.35,2.15 6.77,1.61 | LED1.2 6.77,1.61
N$5
  Top 0.178: R3.2 10.4,7.85 10.95,8.4 LED1.9
  Top 0.356: 10.95,8.4 11.62,8.56 | LED1.9 11.62,8.56 | 10.95,8.4 11.11,9.07 | LED1.9 11.11,9.07 | 10.95,8.4 11.62,8.56 | LED1.9 11.62,8.56 | 10.95,8.4 11.11,9.07 | LED1.9 11.11,9.07 | 10.95,8.4 11.62,8.56 | LED1.9 11.62,8.56 | 10.95,8.4 11.11,9.07 | LED1.9 11.11,9.07 | 10.95,8.4 11.62,8.56 | LED1.9 11.62,8.56 | 10.95,8.4 11.11,9.07 | LED1.9 11.11,9.07
N$6
  Top 0.178: R6.2 8.66,2.08 9.05,1.38 9.02,1.35 LED1.3
  Top 0.356: LED1.3 8.58,1.49 8.73,1.94 9.17,1.73 LED1.3 | 8.66,2.08 8.56,1.41 | LED1.3 8.56,1.41 | 8.66,2.08 9.22,1.7 | LED1.3 9.22,1.7 | 8.66,2.08 8.56,1.41 | LED1.3 8.56,1.41 | 8.66,2.08 9.22,1.7 | LED1.3 9.22,1.7 | 8.66,2.08 8.56,1.41 | LED1.3 8.56,1.41 | 8.66,2.08 9.22,1.7 | LED1.3 9.22,1.7 | 8.66,2.08 8.56,1.41 | LED1.3 8.56,1.41 | 8.66,2.08 9.22,1.7 | LED1.3 9.22,1.7
N$7
  Top 0.178: R7.2 2.4,6.05 1.8,6.65 1.8,7.75 2.4,8.35 2.4,9.55 2.7,9.85 6.1,9.85 6.21,9.74 6.4,9.55 6.4,8.99 6.42,8.97 LED1.11
  Top 0.356: LED1.11 6.09,9.2 6.35,9.6 6.71,9.29 LED1.11 | 6.21,9.74 6.03,9.08 | LED1.11 6.03,9.08 | 6.21,9.74 6.72,9.29 | LED1.11 6.72,9.29 | 6.21,9.74 6.03,9.08 | LED1.11 6.03,9.08 | 6.21,9.74 6.72,9.29 | LED1.11 6.72,9.29 | 6.21,9.74 6.03,9.08 | LED1.11 6.03,9.08 | 6.21,9.74 6.72,9.29 | LED1.11 6.72,9.29 | 6.21,9.74 6.03,9.08 | LED1.11 6.03,9.08 | 6.21,9.74 6.72,9.29 | LED1.11 6.72,9.29
N$8
  Top 0.178: R8.2 3.5,6.05 3.3,6.25 3.1,6.25 2.8,6.55 2.4,6.55 2.2,6.75 2.2,7.65 2.8,8.25 2.8,8.75 3,8.95 3.1,8.95 3.9,8.95 LED1.12
  Top 0.356: LED1.12 3.63,8.64 3.26,8.95 3.61,9.28 LED1.12 | 3.1,8.95 3.69,8.61 | LED1.12 3.69,8.61 | 3.1,8.95 3.67,9.32 | LED1.12 3.67,9.32 | 3.1,8.95 3.69,8.61 | LED1.12 3.69,8.61 | 3.1,8.95 3.67,9.32 | LED1.12 3.67,9.32 | 3.1,8.95 3.69,8.61 | LED1.12 3.69,8.61 | 3.1,8.95 3.67,9.32 | LED1.12 3.67,9.32 | 3.1,8.95 3.69,8.61 | LED1.12 3.69,8.61 | 3.1,8.95 3.67,9.32 | LED1.12 3.67,9.32
N$9
  Top 0.178: R5.2 13.45,8.36 13.49,8.4 LED1.8
  Top 0.356: 13.49,8.4 14.16,8.56 | LED1.8 14.16,8.56 | 13.49,8.4 13.65,9.07 | LED1.8 13.65,9.07 | 13.49,8.4 14.16,8.56 | LED1.8 14.16,8.56 | 13.49,8.4 13.65,9.07 | LED1.8 13.65,9.07 | 13.49,8.4 14.16,8.56 | LED1.8 14.16,8.56 | 13.49,8.4 13.65,9.07 | LED1.8 13.65,9.07 | 13.49,8.4 14.16,8.56 | LED1.8 14.16,8.56 | 13.49,8.4 13.65,9.07 | LED1.8 13.65,9.07
N$10
  Top 0.178: R11.2 19.2,2.33 19.2,1.37 INP.1
  Top 0.356: INP.1 18.77,1.76 19.2,2.13 19.58,1.71 INP.1 | 19.2,2.33 18.69,1.68 | INP.1 18.69,1.68 | 19.2,2.33 19.64,1.63 | INP.1 19.64,1.63 | 19.2,2.33 18.69,1.68 | INP.1 18.69,1.68 | 19.2,2.33 19.64,1.63 | INP.1 19.64,1.63 | 19.2,2.33 18.69,1.68 | INP.1 18.69,1.68 | 19.2,2.33 19.64,1.63 | INP.1 19.64,1.63 | 19.2,2.33 18.69,1.68 | INP.1 18.69,1.68 | 19.2,2.33 19.64,1.63 | INP.1 19.64,1.63
N$11
  Top 0.152: R18.2 8.2,4.15 9.6,2.75 10.4,2.75 11,3.35 13.6,3.35 14.1,3.85 14.3,4.05 15.9,4.05 16,3.95 16,3.5 Q1.B
N$12
  Top 0.178: R13.1 19.2,7.92 19.2,8.89 INN.1
  Top 0.356: INN.1 19.58,8.55 19.2,8.13 18.77,8.5 INN.1 | 19.2,7.92 19.64,8.63 | INN.1 19.64,8.63 | 19.2,7.92 18.69,8.58 | INN.1 18.69,8.58 | 19.2,7.92 19.64,8.63 | INN.1 19.64,8.63 | 19.2,7.92 18.69,8.58 | INN.1 18.69,8.58 | 19.2,7.92 19.64,8.63 | INN.1 19.64,8.63 | 19.2,7.92 18.69,8.58 | INN.1 18.69,8.58 | 19.2,7.92 19.64,8.63 | INN.1 19.64,8.63 | 19.2,7.92 18.69,8.58 | INN.1 18.69,8.58
N$13  (via drill 0.35 pad 0.7)
  Top 0.178: R14.2 18.25,7 18.07,7.18 | 18.07,7.18 v17.7,7.55 | v13.1,4.35 13.6,4.35 13.62,4.37 | 13.62,4.37 14,4.75 14,5.85 14.6,6.45 16.6,6.45 17.33,7.18 | 17.33,7.18 v17.7,7.55 | v17.7,7.55 17.96,7.59 18.02,7.23 17.66,7.29 v17.7,7.55 | v17.7,7.55 17.74,7.29 17.38,7.23 17.44,7.59 v17.7,7.55 | v13.1,4.35 13.25,4.56 13.55,4.35 13.25,4.13 v13.1,4.35 | 18.07,7.18 17.96,7.62 | v17.7,7.55 17.96,7.62 | 18.07,7.18 17.63,7.29 | v17.7,7.55 17.63,7.29 | 17.33,7.18 17.77,7.29 | v17.7,7.55 17.77,7.29 | 17.33,7.18 17.45,7.62 | v17.7,7.55 17.45,7.62 | 13.62,4.37 13.22,4.58 | v13.1,4.35 13.22,4.58 | 13.62,4.37 13.24,4.13 | v13.1,4.35 13.24,4.13 | 18.07,7.18 17.96,7.62 | v17.7,7.55 17.96,7.62 | 18.07,7.18 17.63,7.29 | v17.7,7.55 17.63,7.29 | 17.33,7.18 17.77,7.29 | v17.7,7.55 17.77,7.29 | 17.33,7.18 17.45,7.62 | v17.7,7.55 17.45,7.62 | 18.07,7.18 17.96,7.62 | v17.7,7.55 17.96,7.62 | 18.07,7.18 17.63,7.29 | v17.7,7.55 17.63,7.29 | 18.07,7.18 17.96,7.62 | v17.7,7.55 17.96,7.62 | 18.07,7.18 17.63,7.29 | v17.7,7.55 17.63,7.29 | 17.33,7.18 17.77,7.29 | v17.7,7.55 17.77,7.29 | 17.33,7.18 17.45,7.62 | v17.7,7.55 17.45,7.62 | 17.33,7.18 17.77,7.29 | v17.7,7.55 17.77,7.29 | 17.33,7.18 17.45,7.62 | v17.7,7.55 17.45,7.62 | 13.62,4.37 13.22,4.58 | v13.1,4.35 13.22,4.58 | 13.62,4.37 13.24,4.13 | v13.1,4.35 13.24,4.13 | 13.62,4.37 13.22,4.58 | v13.1,4.35 13.22,4.58 | 13.62,4.37 13.24,4.13 | v13.1,4.35 13.24,4.13 | 13.62,4.37 13.22,4.58 | v13.1,4.35 13.22,4.58 | 13.62,4.37 13.24,4.13 | v13.1,4.35 13.24,4.13
  Top 0.254: R14.2 19.05,5.65 R13.2
  Bottom 0.178: v17.7,7.55 17.7,7.22 17.87,7.05 | 17.87,7.05 C5.2 | U2.6 12.58,4.31 | 12.58,4.31 13.06,4.31 v13.1,4.35 | v17.7,7.55 17.95,7.46 17.82,7.11 17.53,7.35 v17.7,7.55 | v13.1,4.35 12.97,4.12 12.65,4.31 12.93,4.55 v13.1,4.35 | 17.87,7.05 | 17.87,7.05 17.96,7.5 | 17.96,7.5 | v17.7,7.55 17.96,7.5 | 17.87,7.05 17.53,7.35 | v17.7,7.55 17.53,7.35 | 17.87,7.05 17.96,7.5 | v17.7,7.55 17.96,7.5 | 17.87,7.05 17.53,7.35 | v17.7,7.55 17.53,7.35 | 12.58,4.31 12.98,4.11 | v13.1,4.35 12.98,4.11 | 12.58,4.31 12.95,4.57 | v13.1,4.35 12.95,4.57 | 17.87,7.05 17.96,7.5 | v17.7,7.55 17.96,7.5 | 17.87,7.05 17.53,7.35 | v17.7,7.55 17.53,7.35 | 17.87,7.05 17.96,7.5 | v17.7,7.55 17.96,7.5 | 17.87,7.05 17.53,7.35 | v17.7,7.55 17.53,7.35 | 17.87,7.05 17.96,7.5 | v17.7,7.55 17.96,7.5 | 17.87,7.05 17.53,7.35 | v17.7,7.55 17.53,7.35 | 17.87,7.05 17.96,7.5 | v17.7,7.55 17.96,7.5 | 17.87,7.05 17.53,7.35 | v17.7,7.55 17.53,7.35 | 17.87,7.05 17.96,7.5 | v17.7,7.55 17.96,7.5 | 17.87,7.05 17.53,7.35 | v17.7,7.55 17.53,7.35 | 12.58,4.31 12.98,4.11 | v13.1,4.35 12.98,4.11 | 12.58,4.31 12.95,4.57 | v13.1,4.35 12.95,4.57 | 12.58,4.31 12.98,4.11 | v13.1,4.35 12.98,4.11 | 12.58,4.31 12.95,4.57 | v13.1,4.35 12.95,4.57 | 12.58,4.31 12.98,4.11 | v13.1,4.35 12.98,4.11 | 12.58,4.31 12.95,4.57 | v13.1,4.35 12.95,4.57
N$15  (via drill 0.35 pad 0.7)
  Top 0.152: 18.25,3.75 18.05,3.55 16.9,3.55 16.8,3.65 16.4,4.05 16,4.45 15.9,4.45 14.3,4.45 13.6,3.75 10.6,3.75 10.32,3.47 | 10.32,3.47 10.3,3.45 v9.8,3.45 | 10.32,3.47 9.94,3.69 | v9.8,3.45 9.94,3.69 | 10.32,3.47 9.96,3.22 | v9.8,3.45 9.96,3.22 | 10.32,3.47 9.94,3.69 | v9.8,3.45 9.94,3.69 | 10.32,3.47 9.96,3.22 | v9.8,3.45 9.96,3.22 | 10.32,3.47 9.94,3.69 | v9.8,3.45 9.94,3.69 | 10.32,3.47 9.96,3.22 | v9.8,3.45 9.96,3.22 | 10.32,3.47 9.94,3.69 | v9.8,3.45 9.94,3.69 | 10.32,3.47 9.96,3.22 | v9.8,3.45 9.96,3.22
  Top 0.178: 18.4,4.3 R12.1 18.25,3.75 18.25,2.44 | 18.25,2.44 18.25,2.4 v17.9,2.05 | v17.9,2.05 17.86,2.31 18.22,2.37 18.16,2.01 v17.9,2.05 | 18.25,2.44 17.82,2.3 | v17.9,2.05 17.82,2.3 | 18.25,2.44 18.16,2 | v17.9,2.05 18.16,2 | 18.25,2.44 17.82,2.3 | v17.9,2.05 17.82,2.3 | 18.25,2.44 18.16,2 | v17.9,2.05 18.16,2 | 18.25,2.44 17.82,2.3 | v17.9,2.05 17.82,2.3 | 18.25,2.44 18.16,2 | v17.9,2.05 18.16,2 | 18.25,2.44 17.82,2.3 | v17.9,2.05 17.82,2.3 | 18.25,2.44 18.16,2 | v17.9,2.05 18.16,2 | 10.25,3.45 9.95,3.67 v9.8,3.45 9.95,3.23 10.25,3.45
  Top 0.254: R11.1 18.3,4.5 R12.1
  Bottom 0.178: v17.9,2.05 17.9,2.57 | 17.9,2.57 | 17.9,2.57 17.9,2.88 C4.1 | U2.1 9.3,4.04 9.46,3.85 | 9.46,3.85 v9.8,3.45 | v17.9,2.05 17.69,2.2 17.9,2.5 18.12,2.2 v17.9,2.05 | v9.8,3.45 9.54,3.43 9.51,3.8 9.87,3.7 v9.8,3.45 | 17.9,2.57 | 17.9,2.57 17.67,2.18 | v17.9,2.05 17.67,2.18 | 17.9,2.57 18.13,2.18 | v17.9,2.05 18.13,2.18 | 17.9,2.57 17.67,2.18 | v17.9,2.05 17.67,2.18 | 17.9,2.57 18.13,2.18 | v17.9,2.05 18.13,2.18 | 17.9,2.57 17.67,2.18 | v17.9,2.05 17.67,2.18 | 17.9,2.57 18.13,2.18 | v17.9,2.05 18.13,2.18 | 9.46,3.85 9.54,3.41 | v9.8,3.45 9.54,3.41 | 9.46,3.85 9.89,3.7 | v9.8,3.45 9.89,3.7 | 17.9,2.57 17.67,2.18 | v17.9,2.05 17.67,2.18 | 17.9,2.57 18.13,2.18 | v17.9,2.05 18.13,2.18 | 17.9,2.57 17.67,2.18 | v17.9,2.05 17.67,2.18 | 17.9,2.57 18.13,2.18 | v17.9,2.05 18.13,2.18 | 17.9,2.57 17.67,2.18 | v17.9,2.05 17.67,2.18 | 17.9,2.57 18.13,2.18 | v17.9,2.05 18.13,2.18 | 17.9,2.57 17.67,2.18 | v17.9,2.05 17.67,2.18 | 17.9,2.57 18.13,2.18 | v17.9,2.05 18.13,2.18 | 17.9,2.57 17.67,2.18 | v17.9,2.05 17.67,2.18 | 17.9,2.57 18.13,2.18 | v17.9,2.05 18.13,2.18 | 17.9,2.57 17.67,2.18 | v17.9,2.05 17.67,2.18 | 17.9,2.57 18.13,2.18 | v17.9,2.05 18.13,2.18 | 17.9,2.57 17.67,2.18 | v17.9,2.05 17.67,2.18 | 17.9,2.57 18.13,2.18 | v17.9,2.05 18.13,2.18 | 9.46,3.85 9.54,3.41 | v9.8,3.45 9.54,3.41 | 9.46,3.85 9.89,3.7 | v9.8,3.45 9.89,3.7 | 9.46,3.85 9.54,3.41 | v9.8,3.45 9.54,3.41 | 9.46,3.85 9.89,3.7 | v9.8,3.45 9.89,3.7 | 9.46,3.85 9.54,3.41 | v9.8,3.45 9.54,3.41 | 9.46,3.85 9.89,3.7 | v9.8,3.45 9.89,3.7
SCL
  Bottom 0.178: R16.1 9.75,6.63 U2.3
SDA
  Bottom 0.178: 11.96,6.25 U2.4 11.96,6.25 | R17.1 13.45,7.1 12.6,6.25 11.96,6.25
SEGA  (via drill 0.35 pad 0.7)
  Top 0.178: R8.1 3.5,4.05 2.97,3.52 | 2.97,3.52 v2.6,3.15 | v2.6,3.15 2.56,3.41 2.92,3.47 2.86,3.11 v2.6,3.15 | 2.97,3.52 2.53,3.4 | v2.6,3.15 2.53,3.4 | 2.97,3.52 2.85,3.08 | v2.6,3.15 2.85,3.08 | 2.97,3.52 2.53,3.4 | v2.6,3.15 2.53,3.4 | 2.97,3.52 2.85,3.08 | v2.6,3.15 2.85,3.08 | 2.97,3.52 2.53,3.4 | v2.6,3.15 2.53,3.4 | 2.97,3.52 2.85,3.08 | v2.6,3.15 2.85,3.08 | 2.97,3.52 2.53,3.4 | v2.6,3.15 2.53,3.4 | 2.97,3.52 2.85,3.08 | v2.6,3.15 2.85,3.08
  Bottom 0.178: U1.5 3.12,3.17 | 3.12,3.17 2.62,3.17 v2.6,3.15 | v2.6,3.15 2.74,3.37 3.06,3.17 2.76,2.94 v2.6,3.15 | 3.12,3.17 2.72,3.38 | v2.6,3.15 2.72,3.38 | 3.12,3.17 2.74,2.93 | v2.6,3.15 2.74,2.93 | 3.12,3.17 2.72,3.38 | v2.6,3.15 2.72,3.38 | 3.12,3.17 2.74,2.93 | v2.6,3.15 2.74,2.93 | 3.12,3.17 2.72,3.38 | v2.6,3.15 2.72,3.38 | 3.12,3.17 2.74,2.93 | v2.6,3.15 2.74,2.93 | 3.12,3.17 2.72,3.38 | v2.6,3.15 2.72,3.38 | 3.12,3.17 2.74,2.93 | v2.6,3.15 2.74,2.93
SEGB  (via drill 0.35)
  Top 0.178: R7.1 2.4,4.05 1.9,3.55 1.9,2.75 2.3,2.35 2.68,2.35 | 2.68,2.35 | 2.68,2.35 v3.2,2.35 | v3.2,2.35 3.05,2.13 2.75,2.35 3.05,2.56 v3.2,2.35 | 2.68,2.35 | 2.68,2.35 3.07,2.12 | v3.2,2.35 3.07,2.12 | 2.68,2.35 3.07,2.58 | v3.2,2.35 3.07,2.58 | 2.68,2.35 3.07,2.12 | v3.2,2.35 3.07,2.12 | 2.68,2.35 3.07,2.58 | v3.2,2.35 3.07,2.58 | 2.68,2.35 3.07,2.12 | v3.2,2.35 3.07,2.12 | 2.68,2.35 3.07,2.58 | v3.2,2.35 3.07,2.58 | 2.68,2.35 3.07,2.12 | v3.2,2.35 3.07,2.12 | 2.68,2.35 3.07,2.58 | v3.2,2.35 3.07,2.58 | 2.68,2.35 3.07,2.12 | v3.2,2.35 3.07,2.12 | 2.68,2.35 3.07,2.58 | v3.2,2.35 3.07,2.58 | 2.68,2.35 3.07,2.12 | v3.2,2.35 3.07,2.12 | 2.68,2.35 3.07,2.58 | v3.2,2.35 3.07,2.58 | 2.68,2.35 3.07,2.12 | v3.2,2.35 3.07,2.12 | 2.68,2.35 3.07,2.58 | v3.2,2.35 3.07,2.58 | 2.68,2.35 3.07,2.12 | v3.2,2.35 3.07,2.12 | 2.68,2.35 3.07,2.58 | v3.2,2.35 3.07,2.58 | 2.68,2.35 3.07,2.12 | v3.2,2.35 3.07,2.12 | 2.68,2.35 3.07,2.58 | v3.2,2.35 3.07,2.58 | 2.68,2.35 3.07,2.12 | v3.2,2.35 3.07,2.12 | 2.68,2.35 3.07,2.58 | v3.2,2.35 3.07,2.58
  Bottom 0.178: v3.2,2.35 3.73,2.35 | 3.73,2.35 | 3.73,2.35 4,2.35 4.2,2.55 U1.4 | v3.2,2.35 3.35,2.56 3.66,2.35 3.35,2.13 v3.2,2.35 | 3.73,2.35 3.33,2.58 | v3.2,2.35 3.33,2.58 | 3.73,2.35 | 3.73,2.35 3.33,2.12 | v3.2,2.35 3.33,2.12 | 3.73,2.35 3.33,2.58 | v3.2,2.35 3.33,2.58 | 3.73,2.35 3.33,2.12 | v3.2,2.35 3.33,2.12 | 3.73,2.35 3.33,2.58 | v3.2,2.35 3.33,2.58 | 3.73,2.35 3.33,2.12 | v3.2,2.35 3.33,2.12 | 3.73,2.35 3.33,2.58 | v3.2,2.35 3.33,2.58 | 3.73,2.35 3.33,2.12 | v3.2,2.35 3.33,2.12 | 3.73,2.35 3.33,2.58 | v3.2,2.35 3.33,2.58 | 3.73,2.35 3.33,2.12 | v3.2,2.35 3.33,2.12 | 3.73,2.35 3.33,2.58 | v3.2,2.35 3.33,2.58 | 3.73,2.35 3.33,2.12 | v3.2,2.35 3.33,2.12 | 3.73,2.35 3.33,2.58 | v3.2,2.35 3.33,2.58 | 3.73,2.35 3.33,2.12 | v3.2,2.35 3.33,2.12 | 3.73,2.35 3.33,2.58 | v3.2,2.35 3.33,2.58 | 3.73,2.35 3.33,2.12 | v3.2,2.35 3.33,2.12 | 3.73,2.35 3.33,2.58 | v3.2,2.35 3.33,2.58 | 3.73,2.35 3.33,2.12 | v3.2,2.35 3.33,2.12 | 3.73,2.35 3.33,2.58 | v3.2,2.35 3.33,2.58 | 3.73,2.35 3.33,2.12 | v3.2,2.35 3.33,2.12
SEGC  (via drill 0.35 pad 0.7)
  Top 0.178: R6.1 7.15,2.4 v7.7,1.45 | v7.7,1.45 7.44,1.48 7.47,1.84 7.81,1.69 v7.7,1.45 | 7.44,1.9 7.44,1.45 | v7.7,1.45 7.44,1.45 | 7.44,1.9 7.83,1.68 | v7.7,1.45 7.83,1.68 | 7.44,1.9 7.44,1.45 | v7.7,1.45 7.44,1.45 | 7.44,1.9 7.83,1.68 | v7.7,1.45 7.83,1.68 | 7.44,1.9 7.44,1.45 | v7.7,1.45 7.44,1.45 | 7.44,1.9 7.83,1.68 | v7.7,1.45 7.83,1.68 | 7.44,1.9 7.44,1.45 | v7.7,1.45 7.44,1.45 | 7.44,1.9 7.83,1.68 | v7.7,1.45 7.83,1.68
  Bottom 0.178: U1.2 5.2,2.55 5.4,2.35 7.1,2.35 7.41,1.89 | 7.41,1.89 v7.7,1.45 | v7.7,1.45 7.44,1.46 7.45,1.83 7.79,1.7 v7.7,1.45 | 7.41,1.89 7.44,1.43 | v7.7,1.45 7.44,1.43 | 7.41,1.89 7.82,1.69 | v7.7,1.45 7.82,1.69 | 7.41,1.89 7.44,1.43 | v7.7,1.45 7.44,1.43 | 7.41,1.89 7.82,1.69 | v7.7,1.45 7.82,1.69 | 7.41,1.89 7.44,1.43 | v7.7,1.45 7.44,1.43 | 7.41,1.89 7.82,1.69 | v7.7,1.45 7.82,1.69 | 7.41,1.89 7.44,1.43 | v7.7,1.45 7.44,1.43 | 7.41,1.89 7.82,1.69 | v7.7,1.45 7.82,1.69
SEGD  (via drill 0.35, 0.35 pad 0.7)
  Top 0.178: v7.6,6.65 8.12,6.65 | 8.12,6.65 | 8.12,6.65 10.4,6.65 10.93,7.18 | 10.93,7.18 v11.3,7.55 | R5.1 11.79,7.35 | 11.79,7.35 11.5,7.35 v11.3,7.55 | 8.12,6.65 7.73,6.88 | v7.6,6.65 7.73,6.88 | 8.12,6.65 | 8.12,6.65 7.73,6.42 | v7.6,6.65 7.73,6.42 | 8.12,6.65 7.73,6.88 | v7.6,6.65 7.73,6.88 | 8.12,6.65 7.73,6.42 | v7.6,6.65 7.73,6.42 | 8.12,6.65 7.73,6.88 | v7.6,6.65 7.73,6.88 | 8.12,6.65 7.73,6.42 | v7.6,6.65 7.73,6.42 | 10.93,7.18 11.37,7.29 | v11.3,7.55 11.37,7.29 | 10.93,7.18 11.04,7.62 | v11.3,7.55 11.04,7.62 | 11.79,7.35 11.51,7.71 | v11.3,7.55 11.51,7.71 | 11.79,7.35 11.34,7.29 | v11.3,7.55 11.34,7.29 | 8.12,6.65 7.73,6.88 | v7.6,6.65 7.73,6.88 | 8.12,6.65 7.73,6.42 | v7.6,6.65 7.73,6.42 | 8.12,6.65 7.73,6.88 | v7.6,6.65 7.73,6.88 | 8.12,6.65 7.73,6.42 | v7.6,6.65 7.73,6.42 | 8.12,6.65 7.73,6.88 | v7.6,6.65 7.73,6.88 | 8.12,6.65 7.73,6.42 | v7.6,6.65 7.73,6.42 | 8.12,6.65 7.73,6.88 | v7.6,6.65 7.73,6.88 | 8.12,6.65 7.73,6.42 | v7.6,6.65 7.73,6.42 | 8.12,6.65 7.73,6.88 | v7.6,6.65 7.73,6.88 | 8.12,6.65 7.73,6.42 | v7.6,6.65 7.73,6.42 | 8.12,6.65 7.73,6.88 | v7.6,6.65 7.73,6.88 | 8.12,6.65 7.73,6.42 | v7.6,6.65 7.73,6.42 | 8.12,6.65 7.73,6.88 | v7.6,6.65 7.73,6.88 | 8.12,6.65 7.73,6.42 | v7.6,6.65 7.73,6.42 | 10.93,7.18 11.37,7.29 | v11.3,7.55 11.37,7.29 | 10.93,7.18 11.04,7.62 | v11.3,7.55 11.04,7.62 | 11.79,7.35 11.51,7.71 | v11.3,7.55 11.51,7.71 | 11.79,7.35 11.34,7.29 | v11.3,7.55 11.34,7.29 | 10.93,7.18 11.37,7.29 | v11.3,7.55 11.37,7.29 | 10.93,7.18 11.04,7.62 | v11.3,7.55 11.04,7.62 | 10.93,7.18 11.37,7.29 | v11.3,7.55 11.37,7.29 | 10.93,7.18 11.04,7.62 | v11.3,7.55 11.04,7.62 | 11.79,7.35 11.51,7.71 | v11.3,7.55 11.51,7.71 | 11.79,7.35 11.34,7.29 | v11.3,7.55 11.34,7.29 | 11.79,7.35 11.51,7.71
  Top 0.178: v11.3,7.55 11.51,7.71 | 11.79,7.35 11.34,7.29 | v11.3,7.55 11.34,7.29
  Bottom 0.178: U1.16 7.09,6.54 | 7.09,6.54 7.2,6.65 v7.6,6.65 | v11.3,7.55 11.82,7.55 | 11.82,7.55 | 11.82,7.55 R17.2 | 7.09,6.54 7.52,6.4 | v7.6,6.65 7.52,6.4 | 7.09,6.54 7.42,6.84 | v7.6,6.65 7.42,6.84 | 11.82,7.55 11.43,7.78 | v11.3,7.55 11.43,7.78 | 11.82,7.55 | 11.82,7.55 11.43,7.32 | v11.3,7.55 11.43,7.32 | 11.82,7.55 11.43,7.78 | v11.3,7.55 11.43,7.78 | 11.82,7.55 11.43,7.32 | v11.3,7.55 11.43,7.32 | 11.82,7.55 11.43,7.78 | v11.3,7.55 11.43,7.78 | 11.82,7.55 11.43,7.32 | v11.3,7.55 11.43,7.32 | 7.09,6.54 7.52,6.4 | v7.6,6.65 7.52,6.4 | 7.09,6.54 7.42,6.84 | v7.6,6.65 7.42,6.84 | 7.09,6.54 7.52,6.4 | v7.6,6.65 7.52,6.4 | 7.09,6.54 7.42,6.84 | v7.6,6.65 7.42,6.84 | 7.09,6.54 7.52,6.4 | v7.6,6.65 7.52,6.4 | 7.09,6.54 7.42,6.84 | v7.6,6.65 7.42,6.84 | 11.82,7.55 11.43,7.78 | v11.3,7.55 11.43,7.78 | 11.82,7.55 11.43,7.32 | v11.3,7.55 11.43,7.32 | 11.82,7.55 11.43,7.78 | v11.3,7.55 11.43,7.78 | 11.82,7.55 11.43,7.32 | v11.3,7.55 11.43,7.32 | 11.82,7.55 11.43,7.78 | v11.3,7.55 11.43,7.78 | 11.82,7.55 11.43,7.32 | v11.3,7.55 11.43,7.32 | 11.82,7.55 11.43,7.78 | v11.3,7.55 11.43,7.78 | 11.82,7.55 11.43,7.32 | v11.3,7.55 11.43,7.32 | 11.82,7.55 11.43,7.78 | v11.3,7.55 11.43,7.78 | 11.82,7.55 11.43,7.32 | v11.3,7.55 11.43,7.32 | 11.82,7.55 11.43,7.78 | v11.3,7.55 11.43,7.78 | 11.82,7.55 11.43,7.32 | v11.3,7.55 11.43,7.32 | 11.82,7.55 11.43,7.78 | v11.3,7.55 11.43,7.78 | 11.82,7.55 11.43,7.32 | v11.3,7.55 11.43,7.32
SEGE  (via drill 0.35 pad 0.7)
  Top 0.178: R4.1 5.05,2.17 | 5.05,2.17 5.05,1.7 v5.1,1.65 | v5.1,1.65 4.87,1.78 5.05,2.1 5.3,1.83 v5.1,1.65 | 5.05,2.17 4.86,1.76 | v5.1,1.65 4.86,1.76 | 5.05,2.17 5.31,1.8 | v5.1,1.65 5.31,1.8 | 5.05,2.17 4.86,1.76 | v5.1,1.65 4.86,1.76 | 5.05,2.17 5.31,1.8 | v5.1,1.65 5.31,1.8 | 5.05,2.17 4.86,1.76 | v5.1,1.65 4.86,1.76 | 5.05,2.17 5.31,1.8 | v5.1,1.65 5.31,1.8 | 5.05,2.17 4.86,1.76 | v5.1,1.65 4.86,1.76 | 5.05,2.17 5.31,1.8 | v5.1,1.65 5.31,1.8
  Bottom 0.178: v5.1,1.65 4.73,2.02 | 4.73,2.02 4.7,2.05 U1.3 | v5.1,1.65 4.84,1.61 4.78,1.97 5.14,1.91 v5.1,1.65 | 4.73,2.02 4.84,1.58 | v5.1,1.65 4.84,1.58 | 4.73,2.02 5.17,1.91 | v5.1,1.65 5.17,1.91 | 4.73,2.02 4.84,1.58 | v5.1,1.65 4.84,1.58 | 4.73,2.02 5.17,1.91 | v5.1,1.65 5.17,1.91 | 4.73,2.02 4.84,1.58 | v5.1,1.65 4.84,1.58 | 4.73,2.02 5.17,1.91 | v5.1,1.65 5.17,1.91 | 4.73,2.02 4.84,1.58 | v5.1,1.65 4.84,1.58 | 4.73,2.02 5.17,1.91 | v5.1,1.65 5.17,1.91
SEGF  (via drill 0.35)
  Top 0.178: R3.1 8.13,7.85 7.9,7.85 v7.6,7.55 | v7.6,7.55 7.58,7.81 8.03,7.85 7.84,7.44 v7.6,7.55
  Bottom 0.178: U1.20 7.31,4.06 7.5,4.25 7.5,5.55 8.2,6.25 8.2,7 R16.2 8.13,7.25 | 8.13,7.25 8,7.25 v7.6,7.55 | 8.13,7.25 7.94,7.66 v7.6,7.55 | 8.13,7.25 7.68,7.29 v7.6,7.55 | v7.6,7.55 7.84,7.66 8.03,7.25 7.58,7.29 v7.6,7.55 | v7.6,7.55 7.81,7.71 8.09,7.35 7.63,7.29 v7.6,7.55 | v7.6,7.55 7.84,7.67 8.04,7.26 7.58,7.29 v7.6,7.55
SEGG  (via drill 0.35 pad 0.7)
  Top 0.178: v6.5,6.95 6.5,7.47 | 6.5,7.47 | v6.5,6.95 6.3,7.13 6.55,7.4 6.73,7.08 v6.5,6.95 | 6.5,7.47 6.5,7.75 6.9,8.15 7.3,8.15 7.6,8.45 7.6,9.45 8,9.85 14.9,9.85 15.1,9.65 15.1,7.95 R2.1 | 6.5,7.47 | 6.5,7.47 6.27,7.08 | v6.5,6.95 6.27,7.08 | 6.5,7.47 6.73,7.08 | v6.5,6.95 6.73,7.08 | 6.5,7.47 6.27,7.08 | v6.5,6.95 6.27,7.08 | 6.5,7.47 6.73,7.08 | v6.5,6.95 6.73,7.08 | 6.5,7.47 6.27,7.08 | v6.5,6.95 6.27,7.08 | 6.5,7.47 6.73,7.08 | v6.5,6.95 6.73,7.08 | 6.5,7.47 6.27,7.08 | v6.5,6.95 6.27,7.08 | 6.5,7.47 6.73,7.08 | v6.5,6.95 6.73,7.08 | 6.5,7.47 6.27,7.08 | v6.5,6.95 6.27,7.08 | 6.5,7.47 6.73,7.08 | v6.5,6.95 6.73,7.08 | 6.5,7.47 6.27,7.08 | v6.5,6.95 6.27,7.08 | 6.5,7.47 6.73,7.08 | v6.5,6.95 6.73,7.08 | 6.5,7.47 6.27,7.08 | v6.5,6.95 6.27,7.08 | 6.5,7.47 6.73,7.08 | v6.5,6.95 6.73,7.08 | 6.5,7.47 6.27,7.08 | v6.5,6.95 6.27,7.08 | 6.5,7.47 6.73,7.08 | v6.5,6.95 6.73,7.08 | 6.5,7.47 6.27,7.08 | v6.5,6.95 6.27,7.08 | 6.5,7.47 6.73,7.08 | v6.5,6.95 6.73,7.08 | 6.5,7.47 6.27,7.08 | v6.5,6.95 6.27,7.08 | 6.5,7.47 6.73,7.08 | v6.5,6.95 6.73,7.08
  Bottom 0.178: U1.15 5.97,6.93 | 5.97,6.93 6.48,6.93 v6.5,6.95 | v6.5,6.95 6.36,6.73 6.04,6.93 6.34,7.16 v6.5,6.95 | 5.97,6.93 6.38,6.72 | v6.5,6.95 6.38,6.72 | 5.97,6.93 6.36,7.17 | v6.5,6.95 6.36,7.17 | 5.97,6.93 6.38,6.72 | v6.5,6.95 6.38,6.72 | 5.97,6.93 6.36,7.17 | v6.5,6.95 6.36,7.17 | 5.97,6.93 6.38,6.72 | v6.5,6.95 6.38,6.72 | 5.97,6.93 6.36,7.17 | v6.5,6.95 6.36,7.17 | 5.97,6.93 6.38,6.72 | v6.5,6.95 6.38,6.72 | 5.97,6.93 6.36,7.17 | v6.5,6.95 6.36,7.17
VCC  (via drill 0.35 pad 0.7, 0.45)  (1 unrouted)
  Top 0.178: C2.1 12.57,5.25 | 12.57,5.25 | 12.57,5.25 v13.1,5.25 | v13.1,5.25 12.95,5.04 12.64,5.25 12.95,5.46 v13.1,5.25 | 12.57,5.25 | 12.57,5.25 12.97,5.02 | v13.1,5.25 12.97,5.02 | 12.57,5.25 12.97,5.48 | v13.1,5.25 12.97,5.48 | 12.57,5.25 12.97,5.02 | v13.1,5.25 12.97,5.02 | 12.57,5.25 12.97,5.48 | v13.1,5.25 12.97,5.48 | 12.57,5.25 12.97,5.02 | v13.1,5.25 12.97,5.02 | 12.57,5.25 12.97,5.48 | v13.1,5.25 12.97,5.48 | 12.57,5.25 12.97,5.02 | v13.1,5.25 12.97,5.02 | 12.57,5.25 12.97,5.48 | v13.1,5.25 12.97,5.48 | 12.57,5.25 12.97,5.02 | v13.1,5.25 12.97,5.02 | 12.57,5.25 12.97,5.48 | v13.1,5.25 12.97,5.48 | 12.57,5.25 12.97,5.02 | v13.1,5.25 12.97,5.02 | 12.57,5.25 12.97,5.48 | v13.1,5.25 12.97,5.48 | 12.57,5.25 12.97,5.02 | v13.1,5.25 12.97,5.02 | 12.57,5.25 12.97,5.48 | v13.1,5.25 12.97,5.48 | 12.57,5.25 12.97,5.02 | v13.1,5.25 12.97,5.02 | 12.57,5.25 12.97,5.48 | v13.1,5.25 12.97,5.48 | 12.57,5.25 12.97,5.02 | v13.1,5.25 12.97,5.02 | 12.57,5.25 12.97,5.48 | v13.1,5.25 12.97,5.48 | 12.57,5.25 12.97,5.02 | v13.1,5.25 12.97,5.02 | 12.57,5.25 12.97,5.48 | v13.1,5.25 12.97,5.48
  Top 0.381: R15.1 0.8,5.85 D1.C 0.9,5.55 0.9,5.42 | v0.9,4.75 0.9,5.42 | v0.9,4.75 0.7,4.83 0.9,5.33 1.1,4.83 v0.9,4.75 | 0.9,5.42 0.7,4.82 | v0.9,4.75 0.7,4.82 | 0.9,5.42 1.1,4.82 | v0.9,4.75 1.1,4.82 | 0.9,5.42 0.7,4.82 | 0.9,5.42 1.1,4.82 | 0.9,5.42 0.7,4.82 | v0.9,4.75 0.7,4.82 | 0.9,5.42 1.1,4.82 | v0.9,4.75 1.1,4.82 | 0.9,5.42 0.7,4.82 | v0.9,4.75 0.7,4.82 | 0.9,5.42 1.1,4.82 | v0.9,4.75 1.1,4.82 | 0.9,5.42 0.7,4.82 | v0.9,4.75 0.7,4.82 | 0.9,5.42 1.1,4.82 | v0.9,4.75 1.1,4.82 | 0.9,5.42 0.7,4.82 | v0.9,4.75 0.7,4.82 | 0.9,5.42 1.1,4.82 | v0.9,4.75 1.1,4.82 | 0.9,5.42 0.7,4.82 | v0.9,4.75 0.7,4.82 | 0.9,5.42 1.1,4.82 | v0.9,4.75 1.1,4.82 | 0.9,5.42 0.7,4.82 | v0.9,4.75 0.7,4.82 | 0.9,5.42 1.1,4.82 | v0.9,4.75 1.1,4.82 | 0.9,5.42 0.7,4.82 | v0.9,4.75 0.7,4.82 | 0.9,5.42 1.1,4.82 | v0.9,4.75 1.1,4.82 | 0.9,5.42 0.7,4.82 | v0.9,4.75 0.7,4.82 | 0.9,5.42 1.1,4.82 | v0.9,4.75 1.1,4.82
  Bottom 0.178: v13.1,5.25 12.57,5.25 | 12.57,5.25 | 12.57,5.25 U2.5 | R9.2 14.05,5.9 13.59,5.44 | 13.59,5.44 13.4,5.25 v13.1,5.25 | 11.4,5.25 11.1,5.25 10.6,5.75 10.6,7.55 10.3,7.85 10.3,9.55 10,9.85 2.9,9.85 2.7,9.65 2.7,8.25 1.5,7.05 1.5,5.55 1.48,5.55 C3.1 | v13.1,5.25 12.95,5.04 12.64,5.25 12.95,5.46 v13.1,5.25 | v13.1,5.25 13.18,5.5 13.54,5.38 13.31,5.09 v13.1,5.25 | 12.57,5.25 | 12.57,5.25 12.97,5.02 | v13.1,5.25 12.97,5.02 | 12.57,5.25 12.97,5.48 | v13.1,5.25 12.97,5.48 | 12.57,5.25 12.97,5.02 | v13.1,5.25 12.97,5.02 | 12.57,5.25 12.97,5.48 | v13.1,5.25 12.97,5.48 | 12.57,5.25 12.97,5.02 | v13.1,5.25 12.97,5.02 | 12.57,5.25 12.97,5.48 | v13.1,5.25 12.97,5.48 | 13.59,5.44 13.14,5.51 | v13.1,5.25 13.14,5.51 | 13.59,5.44 13.31,5.08 | v13.1,5.25 13.31,5.08 | 12.57,5.25 12.97,5.02 | v13.1,5.25 12.97,5.02 | 12.57,5.25 12.97,5.48 | v13.1,5.25 12.97,5.48 | 13.59,5.44 13.14,5.51 | v13.1,5.25 13.14,5.51 | 13.59,5.44 13.31,5.08 | v13.1,5.25 13.31,5.08 | 12.57,5.25 12.97,5.02 | v13.1,5.25 12.97,5.02 | 12.57,5.25 12.97,5.48 | v13.1,5.25 12.97,5.48 | 12.57,5.25 12.97,5.02 | v13.1,5.25 12.97,5.02 | 12.57,5.25 12.97,5.48 | v13.1,5.25 12.97,5.48 | 12.57,5.25 12.97,5.02 | v13.1,5.25 12.97,5.02 | 12.57,5.25 12.97,5.48 | v13.1,5.25 12.97,5.48 | 12.57,5.25 12.97,5.02 | v13.1,5.25 12.97,5.02 | 12.57,5.25 12.97,5.48 | v13.1,5.25 12.97,5.48 | 12.57,5.25 12.97,5.02 | v13.1,5.25 12.97,5.02 | 12.57,5.25 12.97,5.48 | v13.1,5.25 12.97,5.48 | 12.57,5.25 12.97,5.02 | v13.1,5.25 12.97,5.02 | 12.57,5.25 12.97,5.48 | v13.1,5.25 12.97,5.48 | 13.59,5.44 13.14,5.51 | v13.1,5.25 13.14,5.51 | 13.59,5.44 13.31,5.08 | v13.1,5.25 13.31,5.08 | 13.59,5.44 13.14,5.51 | v13.1,5.25 13.14,5.51 | 13.59,5.44 13.31,5.08
  Bottom 0.178: v13.1,5.25 13.31,5.08
  Bottom 0.254: U1.9 1.47,5.56 C3.1
  Bottom 0.381: 1.48,5.55 1.48,5.33 1.38,5.23 | 1.38,5.23 v0.9,4.75 | v0.9,4.75 0.81,4.94 1.31,5.16 1.09,4.67 v0.9,4.75 | 1.38,5.23 0.8,4.94 | v0.9,4.75 0.8,4.94 | 1.38,5.23 1.09,4.66 | v0.9,4.75 1.09,4.66 | 1.38,5.23 0.8,4.94 | v0.9,4.75 0.8,4.94 | 1.38,5.23 1.09,4.66 | v0.9,4.75 1.09,4.66 | 1.38,5.23 0.8,4.94 | v0.9,4.75 0.8,4.94 | 1.38,5.23 1.09,4.66 | v0.9,4.75 1.09,4.66
  pour Top (isolate 0.229): 0,10.35 17.5,10.35 17.5,-0.05 0,-0.05
  pour Bottom (isolate 0.229): 0,10.35 16.1,10.35 14.7,7.85 13.1,5.55 0,5.55
VCC/2  (via drill 0.35 pad 0.7)
  Top 0.178: R14.1 16.52,5.65 | 16.52,5.65 16.1,5.65 v16,5.75 | R12.2 16.7,4.45 16,5.15 16,5.22 | 16,5.22 | 16,5.22 v16,5.75 | v16,5.75 16.2,5.93 16.44,5.65 16.1,5.51 v16,5.75 | v16,5.75 16.21,5.6 16,5.29 15.79,5.6 v16,5.75 | 16,5.22 16.23,5.62 | v16,5.75 16.23,5.62 | 16,5.22 | 16,5.22 15.77,5.62 | v16,5.75 15.77,5.62 | 16.52,5.65 16.17,5.95 | v16,5.75 16.17,5.95 | 16.52,5.65 16.09,5.5 | v16,5.75 16.09,5.5 | 16,5.22 16.23,5.62 | v16,5.75 16.23,5.62 | 16,5.22 15.77,5.62 | v16,5.75 15.77,5.62 | 16,5.22 16.23,5.62 | v16,5.75 16.23,5.62 | 16,5.22 15.77,5.62 | v16,5.75 15.77,5.62 | 16.52,5.65 16.17,5.95 | v16,5.75 16.17,5.95 | 16.52,5.65 16.09,5.5 | v16,5.75 16.09,5.5 | 16,5.22 16.23,5.62 | v16,5.75 16.23,5.62 | 16,5.22 15.77,5.62 | v16,5.75 15.77,5.62 | 16,5.22 16.23,5.62 | v16,5.75 16.23,5.62 | 16,5.22 15.77,5.62 | v16,5.75 15.77,5.62 | 16,5.22 16.23,5.62 | v16,5.75 16.23,5.62 | 16,5.22 15.77,5.62 | v16,5.75 15.77,5.62 | 16.52,5.65 16.17,5.95 | v16,5.75 16.17,5.95 | 16.52,5.65 16.09,5.5 | v16,5.75 16.09,5.5 | 16.52,5.65 16.17,5.95 | v16,5.75 16.17,5.95 | 16.52,5.65 16.09,5.5 | v16,5.75 16.09,5.5 | 16,5.22 16.23,5.62 | v16,5.75 16.23,5.62 | 16,5.22 15.77,5.62 | v16,5.75 15.77,5.62 | 16,5.22 16.23,5.62 | v16,5.75 16.23,5.62 | 16,5.22 15.77,5.62 | v16,5.75 15.77,5.62 | 16,5.22 16.23,5.62 | v16,5.75 16.23,5.62 | 16,5.22 15.77,5.62 | v16,5.75 15.77,5.62 | 16,5.22 16.23,5.62 | v16,5.75 16.23,5.62 | 16,5.22 15.77,5.62 | v16,5.75 15.77,5.62
  Bottom 0.178: C1.1 R9.1 | R10.2 14.97,4.9 C1.1 | v16,5.75 15.82,5.75 15.62,5.38 | 15.62,5.38 C1.1 | v16,5.75 16.03,5.49 15.66,5.45 15.74,5.81 v16,5.75 | 15.62,5.38 | 15.62,5.38 16.07,5.49 | 16.07,5.49 | 15.62,5.38 | 15.62,5.38 15.75,5.82 | 15.62,5.38 16.07,5.49 | v16,5.75 16.07,5.49 | 15.62,5.38 15.75,5.82 | v16,5.75 15.75,5.82 | 15.62,5.38 16.07,5.49 | v16,5.75 16.07,5.49 | 15.62,5.38 15.75,5.82 | v16,5.75 15.75,5.82 | 15.62,5.38 16.07,5.49 | v16,5.75 16.07,5.49 | 15.62,5.38 15.75,5.82 | v16,5.75 15.75,5.82 | 15.62,5.38 16.07,5.49 | v16,5.75 16.07,5.49 | 15.62,5.38 15.75,5.82 | v16,5.75 15.75,5.82 | 15.62,5.38 16.07,5.49 | v16,5.75 16.07,5.49 | 15.62,5.38 15.75,5.82 | v16,5.75 15.75,5.82 | 15.62,5.38 16.07,5.49 | v16,5.75 16.07,5.49 | 15.62,5.38 15.75,5.82 | v16,5.75 15.75,5.82 | 15.62,5.38 16.07,5.49 | v16,5.75 16.07,5.49 | 15.62,5.38 15.75,5.82 | v16,5.75 15.75,5.82 | 15.62,5.38 16.07,5.49 | v16,5.75 16.07,5.49 | 15.62,5.38 15.75,5.82 | v16,5.75 15.75,5.82 | 15.62,5.38 16.07,5.49 | v16,5.75 16.07,5.49 | 15.62,5.38 15.75,5.82 | v16,5.75 15.75,5.82